# Altium schematic sheet Raspberry_EXT_v1.SchDoc
size A4
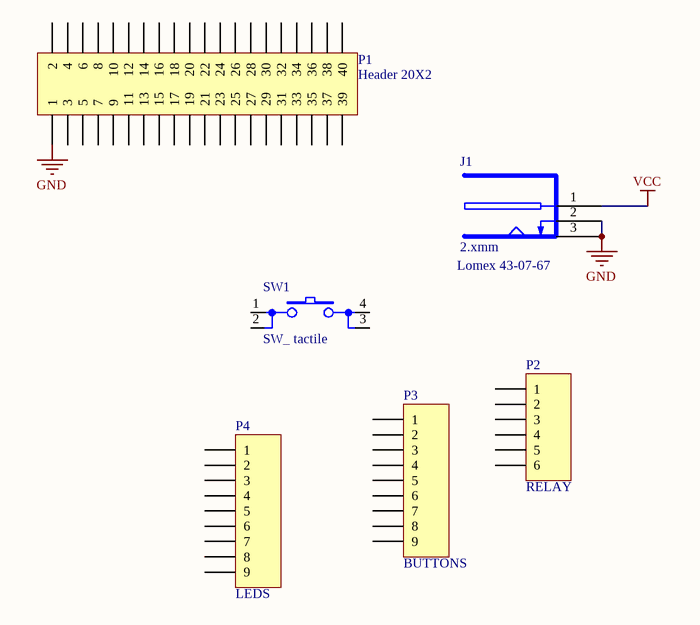
[diagram p0: Raspberry_EXT_v1.SchDoc]

## Parts
J1  2.xmm  Order info: Lomex 43-07-67  [FP_DC_TAP_ANYA]
P1  Header 20X2  [Header_2X20_pin_2.54]
P2  RELAY  [Euroblock 3.5pitch 6P]
P3  BUTTONS  [Euroblock 3.5pitch 9P]
P4  LEDS  [Euroblock 3.5pitch 9P]
SW1  SW_ tactile  [BUTTON_6X6]

## Nets
GND: J1.2(GND) J1.3(GND) P1.1
VCC: J1.1(9V)

Not connected (* = marked no-connect by the designer): P1 2 3 4 5 6 7 8 9 10 11 12 13 14 15 16 17 18 19 20 21 22 23 24 25 26 27 28 29 30 31 32 33 34 35 36 37 38 39 40; P2 1 2 3 4 5 6; P3 1 2 3 4 5 6 7 8 9; P4 1 2 3 4 5 6 7 8 9; SW1 1 2 3 4

## Library data of the parts
J1 = DC_TAP_ANYA: 2.xmm DC HEBA25 TÁPFESZÜLTSÉG ALJZAT ZÁRT, NYÁKBA 90°
P1 = Header 20X2: Header, 20-Pin, Dual row; LatestRevisionDate: 17-Jul-2002; LatestRevisionNote: Re-released for DXP Platform.; Publisher: Altium Limited
P2 = Header 6: Header, 6-Pin; LatestRevisionDate: 17-Jul-2002; LatestRevisionNote: Re-released for DXP Platform.; Publisher: Altium Limited
P3 P4 = Header 9: Header, 9-Pin; LatestRevisionDate: 17-Jul-2002; LatestRevisionNote: Re-released for DXP Platform.; Publisher: Altium Limited